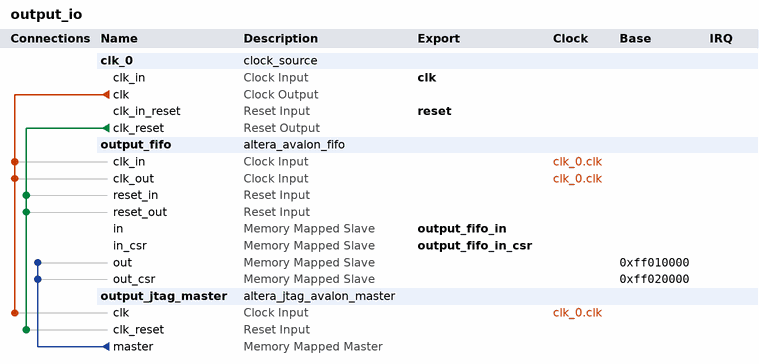
[diagram p0: system contents]
# Platform Designer (Qsys) system output_io, Cyclone V 5CSEMA5F31C6
# Parameters at their usual value, and those the tool derives, are not listed.
package require -exact qsys 20.1
create_system output_io
set_project_property DEVICE_FAMILY {Cyclone V}
set_project_property DEVICE 5CSEMA5F31C6

add_instance clk_0 clock_source 20.1
set_instance_parameter_value clk_0 clockFrequency 50000000

add_instance output_fifo altera_avalon_fifo 20.1
set_instance_parameter_value output_fifo bitsPerSymbol 16
set_instance_parameter_value output_fifo channelWidth 8
set_instance_parameter_value output_fifo errorWidth 8
set_instance_parameter_value output_fifo fifoDepth 16
set_instance_parameter_value output_fifo fifoInputInterfaceOptions AVALONMM_WRITE
set_instance_parameter_value output_fifo fifoOutputInterfaceOptions AVALONMM_READ
set_instance_parameter_value output_fifo singleClockMode false
set_instance_parameter_value output_fifo symbolsPerBeat 2
set_instance_parameter_value output_fifo useIRQ true
set_instance_parameter_value output_fifo usePacket true
set_instance_parameter_value output_fifo useReadControl true

add_instance output_jtag_master altera_jtag_avalon_master 20.1

# connections
add_connection clk_0.clk output_fifo.clk_in clock
add_connection clk_0.clk output_fifo.clk_out clock
add_connection clk_0.clk output_jtag_master.clk clock
add_connection clk_0.clk_reset output_fifo.reset_in reset
add_connection clk_0.clk_reset output_fifo.reset_out reset
add_connection clk_0.clk_reset output_jtag_master.clk_reset reset
add_connection output_jtag_master.master output_fifo.out avalon
set_connection_parameter_value output_jtag_master.master/output_fifo.out baseAddress 0xff010000
add_connection output_jtag_master.master output_fifo.out_csr avalon
set_connection_parameter_value output_jtag_master.master/output_fifo.out_csr baseAddress 0xff020000

# exported interfaces
add_interface clk clock sink
set_interface_property clk EXPORT_OF clk_0.clk_in
add_interface output_fifo_in avalon slave
set_interface_property output_fifo_in EXPORT_OF output_fifo.in
add_interface output_fifo_in_csr avalon slave
set_interface_property output_fifo_in_csr EXPORT_OF output_fifo.in_csr
add_interface reset reset sink
set_interface_property reset EXPORT_OF clk_0.clk_in_reset

set_interconnect_requirement {$system} qsys_mm.clockCrossingAdapter HANDSHAKE
set_interconnect_requirement {$system} qsys_mm.enableEccProtection FALSE
set_interconnect_requirement {$system} qsys_mm.insertDefaultSlave FALSE
set_interconnect_requirement {$system} qsys_mm.maxAdditionalLatency 1

save_system output_io.qsys
